# Altium schematic sheet [14] 1ST_AP1302 ISP.SchDoc
size A3; DocumentNumber: 14; SheetNumber: 14; SheetTotal: 16
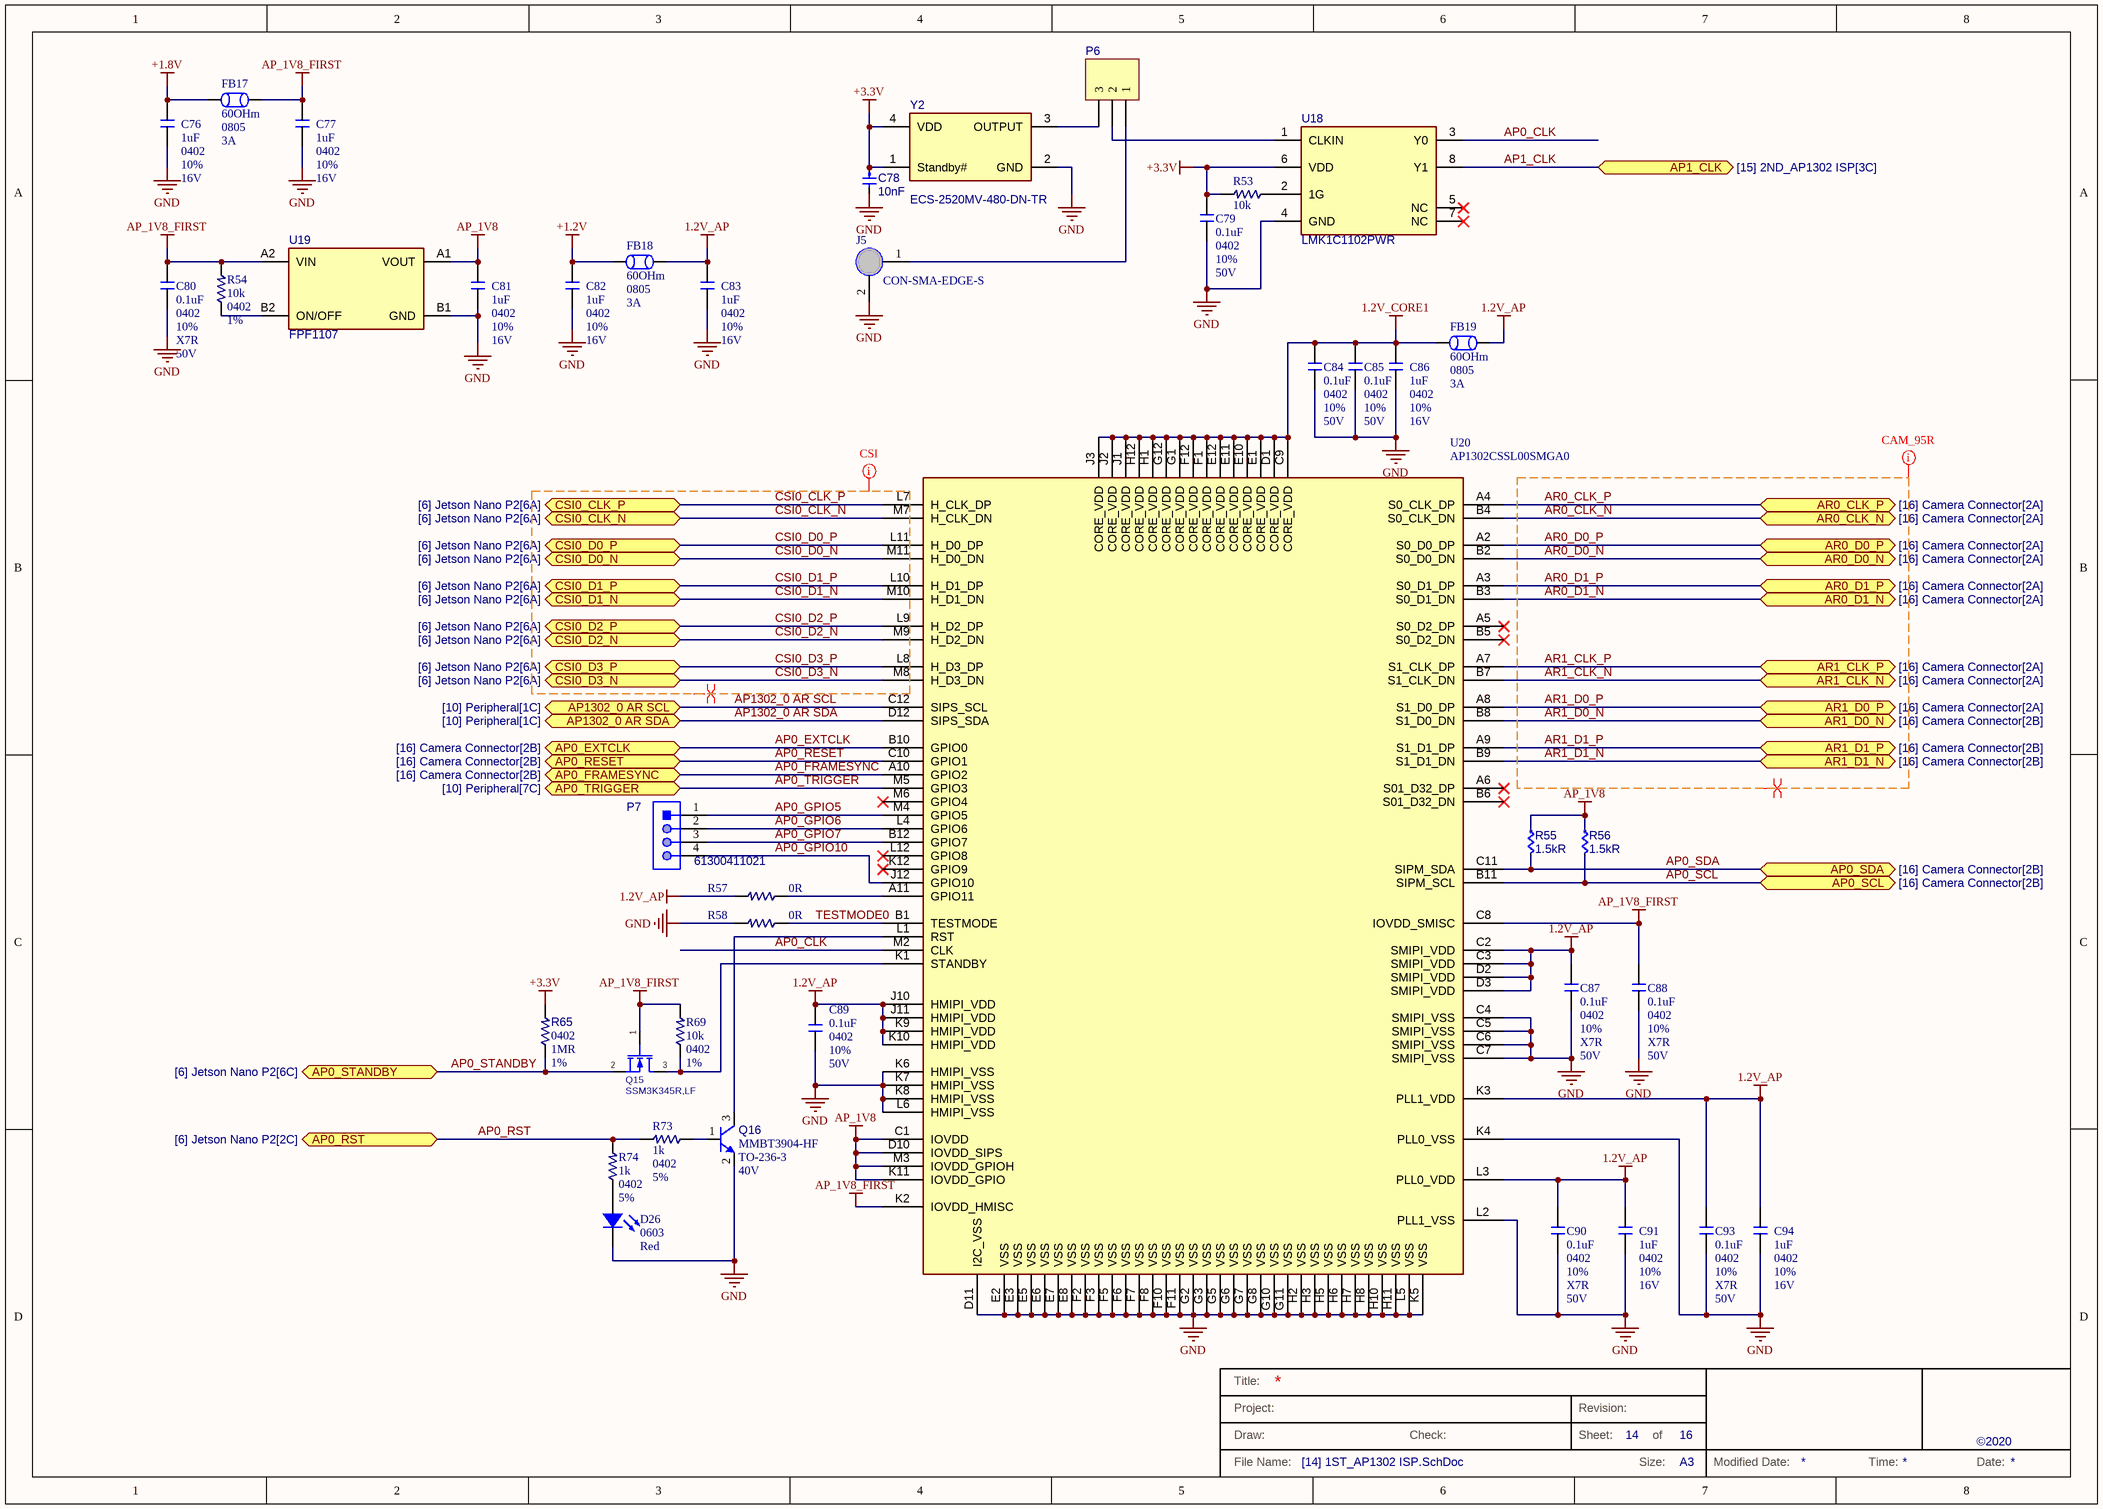
[diagram p0: [14] 1ST_AP1302 ISP.SchDoc]

## Parts
C76  1uF  Case Code (Imperial): 0402  Tolerance: 10%  Voltage: 16V  [C0402M]
C77  1uF  Case Code (Imperial): 0402  Tolerance: 10%  Voltage: 16V  [C0402M]
C78  Capacitance: 10nF  [CAP0402-M]  (hidden comment: 885012205050)
C79  0.1uF  Case/Package: 0402  Tolerance: 10%  Voltage: 50V  [C0402M]
C80  0.1uF  Case/Package: 0402  Tolerance: 10%  Dielectric: X7R  Voltage: 50V  [C0402M]
C81  1uF  Case Code (Imperial): 0402  Tolerance: 10%  Voltage: 16V  [C0402M]
C82  1uF  Case Code (Imperial): 0402  Tolerance: 10%  Voltage: 16V  [C0402M]
C83  1uF  Case Code (Imperial): 0402  Tolerance: 10%  Voltage: 16V  [C0402M]
C84  0.1uF  Case/Package: 0402  Tolerance: 10%  Voltage: 50V  [C0402M]
C85  0.1uF  Case/Package: 0402  Tolerance: 10%  Voltage: 50V  [C0402M]
C86  1uF  Case Code (Imperial): 0402  Tolerance: 10%  Voltage: 16V  [C0402M]
C87  0.1uF  Case/Package: 0402  Tolerance: 10%  Dielectric: X7R  Voltage: 50V  [C0402M]
C88  0.1uF  Case/Package: 0402  Tolerance: 10%  Dielectric: X7R  Voltage: 50V  [C0402M]
C89  0.1uF  Case/Package: 0402  Tolerance: 10%  Voltage: 50V  [C0402M]
C90  0.1uF  Case/Package: 0402  Tolerance: 10%  Dielectric: X7R  Voltage: 50V  [C0402M]
C91  1uF  Case Code (Imperial): 0402  Tolerance: 10%  Voltage: 16V  [C0402M]
C93  0.1uF  Case/Package: 0402  Tolerance: 10%  Dielectric: X7R  Voltage: 50V  [C0402M]
C94  1uF  Case Code (Imperial): 0402  Tolerance: 10%  Voltage: 16V  [C0402M]
D26  Case/Package: 0603  Color: Red  [LED-0603]  (hidden comment: LTST-C190CKT)
FB17  60OHm  Case Code (Imperial): 0805  Max DC Current: 3A  [R0805M]
FB18  60OHm  Case Code (Imperial): 0805  Max DC Current: 3A  [R0805M]
FB19  60OHm  Case Code (Imperial): 0805  Max DC Current: 3A  [R0805M]
J5  CON-SMA-EDGE-S  [CON-SMA-EDGE-S]
P6  Header 3  [HDR1X3]  (value not drawn)  (no BOM)
P7  61300411021  [61300411021]
Q15  SSM3K345R,LF  [SSM3K345R,LF-Footprint-1]
Q16  Manufacturer Part Number 1: MMBT3904-HF  Case/Package: TO-236-3  Collector Emitter Breakdown Voltage: 40V  [SOT55P160X90-3N]  (hidden comment: NPN)
R53  10k  [R0402M]
R54  10k  Case Code (Imperial): 0402  Tolerance: 1%  [R0402M]
R55  Resistance: 1.5kR  [RES0402]  (hidden comment: ERJ-2RKF1501X)
R56  Resistance: 1.5kR  [RES0402]  (hidden comment: ERJ-2RKF1501X)
R57  Resistance: 0R  [R0402M]  (hidden comment: RC0402FR-070RL)
R58  Resistance: 0R  [R0402M]  (hidden comment: RC0402FR-070RL)
R65  Case Code (Imperial): 0402  Resistance: 1MR  Tolerance: 1%  [R0402M]  (hidden comment: 1M)
R69  10k  Case Code (Imperial): 0402  Tolerance: 1%  [R0402M]
R73  1k  Case Code (Imperial): 0402  Tolerance: 5%  [R0402M]
R74  1k  Case Code (Imperial): 0402  Tolerance: 5%  [R0402M]
U18  LMK1C1102PWR  [LMK1C1102PWR]
U19  FPF1107  [FPF1107]
U20  AP1302CSSL00SMGA0  [AP1302CSSL00SMGA0]
Y2  ECS-2520MV-480-DN-TR  [ECS-2520MV-480-DN-TR]

## Ports
AP0_EXTCLK (bidir, see [16] Camera Connector[2B]), AP0_FRAMESYNC (bidir, see [16] Camera Connector[2B]), AP0_RESET (bidir, see [16] Camera Connector[2B]), AP0_RST (bidir, see [6] Jetson Nano P2[2C]), AP0_SCL (bidir, see [16] Camera Connector[2B]), AP0_SDA (bidir, see [16] Camera Connector[2B]), AP0_STANDBY (bidir, see [6] Jetson Nano P2[6C]), AP0_TRIGGER (bidir, see [10] Peripheral[7C]), AP1_CLK (bidir, see [15] 2ND_AP1302 ISP[3C]), AP1302_0 AR SCL (bidir, see [10] Peripheral[1C]), AP1302_0 AR SDA (bidir, see [10] Peripheral[1C]), AR0_CLK_N (bidir, see [16] Camera Connector[2A]), AR0_CLK_P (bidir, see [16] Camera Connector[2A]), AR0_D0_N (bidir, see [16] Camera Connector[2A]), AR0_D0_P (bidir, see [16] Camera Connector[2A]), AR0_D1_N (bidir, see [16] Camera Connector[2A]), AR0_D1_P (bidir, see [16] Camera Connector[2A]), AR1_CLK_N (bidir, see [16] Camera Connector[2A]), AR1_CLK_P (bidir, see [16] Camera Connector[2A]), AR1_D0_N (bidir, see [16] Camera Connector[2B]), AR1_D0_P (bidir, see [16] Camera Connector[2A]), AR1_D1_N (bidir, see [16] Camera Connector[2B]), AR1_D1_P (bidir, see [16] Camera Connector[2B]), CSI0_CLK_N (bidir, see [6] Jetson Nano P2[6A]), CSI0_CLK_P (bidir, see [6] Jetson Nano P2[6A]), CSI0_D0_N (bidir, see [6] Jetson Nano P2[6A]), CSI0_D0_P (bidir, see [6] Jetson Nano P2[6A]), CSI0_D1_N (bidir, see [6] Jetson Nano P2[6A]), CSI0_D1_P (bidir, see [6] Jetson Nano P2[6A]), CSI0_D2_N (bidir, see [6] Jetson Nano P2[6A]), CSI0_D2_P (bidir, see [6] Jetson Nano P2[6A]), CSI0_D3_N (bidir, see [6] Jetson Nano P2[6A]), CSI0_D3_P (bidir, see [6] Jetson Nano P2[6A])

## Nets
1.2V_AP: C83.1 C87.1 C89.1 C90.1 C91.1 C93.1 C94.1 FB18.1 FB19.1 R57.1 U20.C2(SMIPI_VDD) U20.C3(SMIPI_VDD) U20.D2(SMIPI_VDD) U20.D3(SMIPI_VDD) U20.J10(HMIPI_VDD) U20.J11(HMIPI_VDD) U20.K3(PLL1_VDD) U20.K9(HMIPI_VDD) U20.K10(HMIPI_VDD) U20.L3(PLL0_VDD)
1.2V_CORE1: C84.1 C85.1 C86.1 FB19.2 U20.C9(CORE_VDD) U20.D1(CORE_VDD) U20.E1(CORE_VDD) U20.E10(CORE_VDD) U20.E11(CORE_VDD) U20.E12(CORE_VDD) U20.F1(CORE_VDD) U20.F12(CORE_VDD) U20.G1(CORE_VDD) U20.G12(CORE_VDD) U20.H1(CORE_VDD) U20.H12(CORE_VDD) U20.J1(CORE_VDD) U20.J2(CORE_VDD) U20.J3(CORE_VDD)
+1.2V: C82.1 FB18.2
+1.8V: C76.1 FB17.2
+3.3V: C78.1 C79.1 R53.1 R65.1 U18.6(VDD) Y2.1(Standby#) Y2.4(VDD)
AP_1V8: C81.1 R55.1 R56.1 U19.A1(VOUT) U20.C1(IOVDD) U20.D10(IOVDD_SIPS) U20.K11(IOVDD_GPIO) U20.M3(IOVDD_GPIOH)
AP_1V8_FIRST: C77.1 C80.1 C88.1 FB17.1 Q15.1(G) R54.1 R69.1 U19.A2(VIN) U20.C8(IOVDD_SMISC) U20.K2(IOVDD_HMISC)
GND: C76.2 C77.2 C78.2 C79.2 C80.2 C81.2 C82.2 C83.2 C84.2 C85.2 C86.2 C87.2 C88.2 C89.2 C90.2 C91.2 C93.2 C94.2 D26.2(K) J5.2(GND) Q16.2(E) R58.1 U18.4(GND) U19.B1(GND) U20.C4(SMIPI_VSS) U20.C5(SMIPI_VSS) U20.C6(SMIPI_VSS) U20.C7(SMIPI_VSS) U20.D11(I2C_VSS) U20.E2(VSS) U20.E3(VSS) U20.E5(VSS) U20.E6(VSS) U20.E7(VSS) U20.E8(VSS) U20.F2(VSS) U20.F3(VSS) U20.F5(VSS) U20.F6(VSS) U20.F7(VSS) U20.F8(VSS) U20.F10(VSS) U20.F11(VSS) U20.G2(VSS) U20.G3(VSS) U20.G5(VSS) U20.G6(VSS) U20.G7(VSS) U20.G8(VSS) U20.G10(VSS) U20.G11(VSS) U20.H2(VSS) U20.H3(VSS) U20.H5(VSS) U20.H6(VSS) U20.H7(VSS) U20.H8(VSS) U20.H10(VSS) U20.H11(VSS) U20.K4(PLL0_VSS) U20.K5(VSS) U20.K6(HMIPI_VSS) U20.K7(HMIPI_VSS) U20.K8(HMIPI_VSS) U20.L2(PLL1_VSS) U20.L5(VSS) U20.L6(HMIPI_VSS) Y2.2(GND)
AP0_CLK: U18.3(Y0) U20.M2(CLK)
AP0_EXTCLK: U20.B10(GPIO0) ; port AP0_EXTCLK
AP0_FRAMESYNC: U20.A10(GPIO2) ; port AP0_FRAMESYNC
AP0_GPIO5: P7.1 U20.M4(GPIO5)
AP0_GPIO6: P7.2 U20.L4(GPIO6)
AP0_GPIO7: P7.3 U20.B12(GPIO7)
AP0_GPIO10: P7.4 U20.J12(GPIO10)
AP0_RESET: U20.C10(GPIO1) ; port AP0_RESET
AP0_RST: R73.1 R74.1 ; port AP0_RST
AP0_SCL: R56.2 U20.B11(SIPM_SCL) ; port AP0_SCL
AP0_SDA: R55.2 U20.C11(SIPM_SDA) ; port AP0_SDA
AP0_STANDBY: Q15.2(S) R65.2 ; port AP0_STANDBY
AP0_TRIGGER: U20.M5(GPIO3) ; port AP0_TRIGGER
AP1_CLK: U18.8(Y1) ; port AP1_CLK
AP1302_0 AR SCL: U20.C12(SIPS_SCL) ; port AP1302_0 AR SCL
AP1302_0 AR SDA: U20.D12(SIPS_SDA) ; port AP1302_0 AR SDA
AR0_CLK_N: U20.B4(S0_CLK_DN) ; port AR0_CLK_N
AR0_CLK_P: U20.A4(S0_CLK_DP) ; port AR0_CLK_P
AR0_D0_N: U20.B2(S0_D0_DN) ; port AR0_D0_N
AR0_D0_P: U20.A2(S0_D0_DP) ; port AR0_D0_P
AR0_D1_N: U20.B3(S0_D1_DN) ; port AR0_D1_N
AR0_D1_P: U20.A3(S0_D1_DP) ; port AR0_D1_P
AR1_CLK_N: U20.B7(S1_CLK_DN) ; port AR1_CLK_N
AR1_CLK_P: U20.A7(S1_CLK_DP) ; port AR1_CLK_P
AR1_D0_N: U20.B8(S1_D0_DN) ; port AR1_D0_N
AR1_D0_P: U20.A8(S1_D0_DP) ; port AR1_D0_P
AR1_D1_N: U20.B9(S1_D1_DN) ; port AR1_D1_N
AR1_D1_P: U20.A9(S1_D1_DP) ; port AR1_D1_P
CSI0_CLK_N: U20.M7(H_CLK_DN) ; port CSI0_CLK_N
CSI0_CLK_P: U20.L7(H_CLK_DP) ; port CSI0_CLK_P
CSI0_D0_N: U20.M11(H_D0_DN) ; port CSI0_D0_N
CSI0_D0_P: U20.L11(H_D0_DP) ; port CSI0_D0_P
CSI0_D1_N: U20.M10(H_D1_DN) ; port CSI0_D1_N
CSI0_D1_P: U20.L10(H_D1_DP) ; port CSI0_D1_P
CSI0_D2_N: U20.M9(H_D2_DN) ; port CSI0_D2_N
CSI0_D2_P: U20.L9(H_D2_DP) ; port CSI0_D2_P
CSI0_D3_N: U20.M8(H_D3_DN) ; port CSI0_D3_N
CSI0_D3_P: U20.L8(H_D3_DP) ; port CSI0_D3_P
TESTMODE0: R58.2 U20.B1(TESTMODE)
NetD26_1: D26.1(A) R74.2
NetJ5_1: J5.1(SIG) P6.1
NetP6_2: P6.2 U18.1(CLKIN)
NetP6_3: P6.3 Y2.3(OUTPUT)
NetQ15_3: Q15.3(D) R69.2 U20.K1(STANDBY)
NetQ16_1: Q16.1(B) R73.2
NetQ16_3: Q16.3(C) U20.L1(RST)
NetR53_2: R53.2 U18.2(1G)
NetR54_2: R54.2 U19.B2(ON/OFF)
NetR57_2: R57.2 U20.A11(GPIO11)

Not connected (* = marked no-connect by the designer): U18 5(NC)* 7(NC)*; U20 A5(S0_D2_DP)* A6(S01_D32_DP)* B5(S0_D2_DN)* B6(S01_D32_DN)* K12(GPIO9)* L12(GPIO8)* M6(GPIO4)*

## Layout directives
net class CAM_95R: AR0_CLK_N, AR0_CLK_P, AR0_D0_N, AR0_D0_P, AR0_D1_N, AR0_D1_P, AR1_CLK_N, AR1_CLK_P, AR1_D0_N, AR1_D0_P, AR1_D1_N, AR1_D1_P
differential pair: AR0_CLK_N, AR0_CLK_P, AR0_D0_N, AR0_D0_P, AR0_D1_N, AR0_D1_P, AR1_CLK_N, AR1_CLK_P, AR1_D0_N, AR1_D0_P, AR1_D1_N, AR1_D1_P, CSI0_CLK_N, CSI0_CLK_P, CSI0_D0_N, CSI0_D0_P, CSI0_D1_N, CSI0_D1_P, CSI0_D2_N, CSI0_D2_P, CSI0_D3_N, CSI0_D3_P
net class CSI: CSI0_CLK_N, CSI0_CLK_P, CSI0_D0_N, CSI0_D0_P, CSI0_D1_N, CSI0_D1_P, CSI0_D2_N, CSI0_D2_P, CSI0_D3_N, CSI0_D3_P

## Notes on the sheet
- Title:
- Project:
- Draw:
- Check:
- Revision:
- Sheet:
- of
- ©2020
- File Name:
- Size:
- A3
- Modified Date:
- Time:
- Date:

## Library data of the parts
C76 C77 C81-C83 C86 C91 C94 = CAP_CER: SAMSUNG ELECTRO-MECHANICS - CL05A105KO5NNNC - SMD Multilayer Ceramic Capacitor, 1 µF, 16 V, 0402 [1005 Metric], ± 10%, X5R, CL Series; Supplier 1: Digi-Key; Supplier Part Number 1: 1276-1067-1-ND; Manufacturer 1: Samsung; Manufacturer Part Number 1: CL05A105KO5NNNC; Stock 1: 1039902; Pricing 1: 1=0.10000, 10=0.04600, 50=0.02520, 100=0.02050, 500=0.01466, 1000=0.01151, 2500=0.01046, 5000=0.00963 (USD); RoHS: Yes; Mount: Surface Mount; Case/Package: 0402; Case Code (Metric): 1005; Contact Plating: Tin; Min Operating Temperature: -55°C; Max Operating Temperature: 85°C; Capacitance: 1uF; Dielectric: X5R; Packaging: Tape and Reel; Package Quantity: 1; Voltage Rating: 16V; Series: CL; Construction: Flat; Length: 1mm; Width: 0.02inch; Height: 0.5mm; Thickness: 0.022inch; Depth: 0.5mm; Radiation Hardening: No; RoHS Compliant: Yes; ComponentLink1URL: https://datasheet.ciiva.com/16207/cl05a105ko5nnnc-16207571.pdf?src-supplier=Future+Electronics; ComponentLink1Description: https://datasheet.ciiva.com/16207/cl05a105ko5nnnc-16207571.pdf?src-supplier=Future+Electronics; ComponentLink2URL: https://datasheet.ciiva.com/15195/getdatasheetpartid-355272-15195629.pdf?src-supplier=Verical; ComponentLink2Description: https://datasheet.ciiva.com/15195/getdatasheetpartid-355272-15195629.pdf?src-supplier=Verical
C78 = CMP-01521-1: CAP CER 10000PF 25V X7R 0402; Manufacturer 1: Würth Elektronik; Tolerance: 10%; RoHS Compliant: Yes; Thickness: 0.022inch; Case Code (Imperial): 0402; Length: 0.039inch; Width: 0.02inch; Mount: Surface Mount; Voltage Rating: 25V; Case/Package: 0402; Min Operating Temperature: -55°C; Max Operating Temperature: 125°C; Case Code (Metric): 1005; Manufacturer Part Number 1: 885012205050; Packaging: Tape and Reel
C79 C80 C84 C85 C87-C90 C93 = CAP_CER: CAP CER 0.1UF 50V X7R 0402; Manufacturer: Murata; Manufacturer Part Number: GRM155R71H104KE14D; Material: Ceramic; Capacitance: 100nF; Dissipation Factor: 0.025%; ComponentLink1URL: https://datasheet.ciiva.com/25741/cl10b104kb8nnnl-25741341.pdf?src-supplier=Digi-Key; ComponentLink1Description: https://datasheet.ciiva.com/25741/cl10b104kb8nnnl-25741341.pdf?src-supplier=Digi-Key; ComponentLink2URL: https://datasheet.ciiva.com/26838/getdatasheetpartid-357523-26838415.pdf?src-supplier=Verical; ComponentLink2Description: https://datasheet.ciiva.com/26838/getdatasheetpartid-357523-26838415.pdf?src-supplier=Verical; Supplier 1: Digi-Key; Supplier Part Number 1: 490-10700-1-ND; Stock 1: 2282266; Pricing 1: 1 = 0.10000, 10 = 0.04600, 100 = 0.02050, 500 = 0.01464, 1000 = 0.01150, 2500 = 0.01045, 5000 = 0.00961 (USD); RoHS: Yes; Mount: Surface Mount; Weight: 0.000212oz; Case Code (Metric): 1005; Case Code (Imperial): 0402; Dielectric Material: Ceramic; Min Operating Temperature: -55°C; Max Operating Temperature: 125°C; Packaging: Tape and Reel; Voltage Rating: 50V; Termination: SMD/SMT; Composition: Ceramic; Voltage Rating (DC): 50V; Package Quantity: 10000; Length: 1mm; Height: 0.5mm; Width: 0.5mm; Thickness: 0.022inch; Depth: 0.5mm; REACH SVHC: No SVHC; Lead Free: Lead Free; ComponentLink3URL: http://www.farnell.com/datasheets/2079156.pdf?src-supplier=Farnell; ComponentLink3Description: http://www.farnell.com/datasheets/2079156.pdf?src-supplier=Farnell; ComponentLink4URL: http://www.mouser.com/ds/2/281/c02e-2905.pdf?src-supplier=Mouser; ComponentLink4Description: http://www.mouser.com/ds/2/281/c02e-2905.pdf?src-supplier=Mouser; ComponentLink5URL: http://components.arrow.com/part/dataview/0323_07030614?src-supplier=Arrow+Europe; ComponentLink5Description: http://components.arrow.com/part/dataview/0323_07030614?src-supplier=Arrow+Europe; ComponentLink6URL: https://search.murata.co.jp/Ceramy/image/img/A01X/G101/ENG/GRM155R71H104KE14-01.pdf?src-supplier=Digi-Key; ComponentLink6Description: https://search.murata.co.jp/Ceramy/image/img/A01X/G101/ENG/GRM155R71H104KE14-01.pdf?src-supplier=Digi-Key; ComponentLink7URL: http://psearch.en.murata.com/capacitor/product/GRM155R71H104KE14%23.pdf?src-supplier=Avnet; ComponentLink7Description: http://psearch.en.murata.com/capacitor/product/GRM155R71H104KE14%23.pdf?src-supplier=Avnet; ComponentLink8URL: http://www.farnell.com/datasheets/2079156.pdf?src-supplier=Element14; ComponentLink8Description: http://www.farnell.com/datasheets/2079156.pdf?src-supplier=Element14; ComponentLink9URL: http://www.farnell.com/datasheets/2079156.pdf?src-supplier=Newark; ComponentLink9Description: http://www.farnell.com/datasheets/2079156.pdf?src-supplier=Newark
  C79 C84 C85 C89: Dielectric: X7R
D26 = Led: LED RED CLEAR CHIP SMD; Manufacturer 1: Vishay Lite-On; Lens Color: Colorless; Lens Style: Diffused,Colorless,Rectangular,Clear; Forward Voltage: 1.8V; Viewing Angle: 130°; Forward Current: 20mA; Luminous Intensity: 10mcd; Dominant Wavelength: 638nm; Test Current: 10mA; Number of Elements: 1; Power Dissipation: 62.5mW; Wavelength: 660nm; Reverse Voltage: 5V; Power Rating: 100mW; Supplier 1: Digi-Key; Supplier Part Number 1: 160-1181-1-ND; Manufacturer Part Number 1: LTST-C190CKT; RoHS: Yes; Category: LEDs; Stock 1: 143500; Pricing 1: 1=0.30000 (USD); Mount: Surface Mount; Number of Pins: 2; Case Code (Metric): 1608; Case Code (Imperial): 0603; Min Operating Temperature: -30°C; Max Operating Temperature: 85°C; Packaging: Tape and Reel; Package Quantity: 1; Illumination Color: Red; Lens Transparency: Clear; Number of LEDs: 1; Max Power Dissipation: 100mW; Length: 1.6mm; Width: 0.8mm; Height: 0.8mm; Depth: 0.8mm; Radiation Hardening: No; Lead Free: Lead Free; RoHS Compliant: Yes; ComponentLink1URL: https://datasheet.ciiva.com/2110/ltst-c190ckt-2110129.pdf?src-supplier=Digi-Key; ComponentLink1Description: https://datasheet.ciiva.com/2110/ltst-c190ckt-2110129.pdf?src-supplier=Digi-Key; ComponentLink2URL: https://datasheet.ciiva.com/15201/getdatasheetpartid-245581-15201387.pdf?src-supplier=Verical; ComponentLink2Description: https://datasheet.ciiva.com/15201/getdatasheetpartid-245581-15201387.pdf?src-supplier=Verical; ComponentLink3URL: https://datasheet.ciiva.com/11773/0900766b80dc029f-11773615.pdf?src-supplier=RSComponents; ComponentLink3Description: https://datasheet.ciiva.com/11773/0900766b80dc029f-11773615.pdf?src-supplier=RSComponents; ComponentLink4URL: https://datasheet.ciiva.com/12400/lite-on-ltst-c190ckt-187378-12400679.pdf?src-supplier=Mouser; ComponentLink4Description: https://datasheet.ciiva.com/12400/lite-on-ltst-c190ckt-187378-12400679.pdf?src-supplier=Mouser; ComponentLink5URL: https://datasheet.ciiva.com/16287/lite-on20ltst-c190ckt-16287002.pdf?src-supplier=Future+Electronics; ComponentLink5Description: https://datasheet.ciiva.com/16287/lite-on20ltst-c190ckt-16287002.pdf?src-supplier=Future+Electronics; ComponentLink6URL: https://datasheet.ciiva.com/2110/ltst-c190ckt-2110131.pdf?src-supplier=Digi-Key; ComponentLink6Description: https://datasheet.ciiva.com/2110/ltst-c190ckt-2110131.pdf?src-supplier=Digi-Key; ComponentLink7URL: https://datasheet.ciiva.com/2110/ltst-c190ckt-2110130.pdf?src-supplier=Digi-Key; ComponentLink7Description: https://datasheet.ciiva.com/2110/ltst-c190ckt-2110130.pdf?src-supplier=Digi-Key
FB17-FB19 = FB: TAIYO YUDEN - BKP2125HS600-T - Ferrite Bead, 0805 [2012 Metric], 60 ohm, 3 A, BKP Series, 0.025 ohm, ± 25%; Impedance: 60R; DC Resistance (DCR): 25mR; Test Frequency: 100MHz; Number of Lines: 1; Shielding: Unshielded; Supplier 1: Digi-Key; Supplier Part Number 1: 587-1932-1-ND; Manufacturer 1: Taiyo Yuden; Manufacturer Part Number 1: BKP2125HS600-T; Stock 1: 181157; Pricing 1: 1=0.12000, 10=0.09400, 25=0.08480, 50=0.06200, 100=0.05360, 250=0.04232, 500=0.03574, 1000=0.03010 (USD); RoHS: Yes; Mount: Surface Mount; Case/Package: 0805; Number of Pins: 2; Core Material: Ferrite; Case Code (Metric): 2125; Min Operating Temperature: -55°C; Max Operating Temperature: 85°C; Tolerance: 25%; Packaging: Tape and Reel; Package Quantity: 1; Termination: SMD/SMT; Max Current Rating: 3A; Resistance: 25mR; Series: BK; Length: 2.3mm; Width: 0.049inch; Height: 1.05mm; Depth: 1.45mm; RoHS Compliant: Yes; Lead Free: Lead Free; Halogen Free: Halogen Free; REACH SVHC: Unknown; ComponentLink1URL: https://datasheet.ciiva.com/6213/bkp2125hs600-t-ss-6213090.pdf?src-supplier=Digi-Key; ComponentLink1Description: https://datasheet.ciiva.com/6213/bkp2125hs600-t-ss-6213090.pdf?src-supplier=Digi-Key; ComponentLink2URL: https://datasheet.ciiva.com/30063/884bkp2125hs600-t-30063956.pdf?src-supplier=Onlinecomponents.com; ComponentLink2Description: https://datasheet.ciiva.com/30063/884bkp2125hs600-t-30063956.pdf?src-supplier=Onlinecomponents.com; ComponentLink3URL: https://datasheet.ciiva.com/6213/mlci08-e-6213094.pdf?src-supplier=Digi-Key; ComponentLink3Description: https://datasheet.ciiva.com/6213/mlci08-e-6213094.pdf?src-supplier=Digi-Key; ComponentLink4URL: https://datasheet.ciiva.com/6213/mlci08-e-6213097.pdf?src-supplier=Digi-Key; ComponentLink4Description: https://datasheet.ciiva.com/6213/mlci08-e-6213097.pdf?src-supplier=Digi-Key
J5 = AntenaIPX: Sma Female Connector, Pcb Edge Mount Rohs Compliant: Yes; Manufacturer 1: RF Solutions; Connector Type: SMA,Socket; Number of Ports: 1; Supplier 1: RSComponents; Supplier Part Number 1: 1258191; Manufacturer Part Number 1: CON-SMA-EDGE-S; RoHS: Yes; Category: RF / Coaxial Connectors; Stock 1: 594; Pricing 1: 1=2.06000, 10=1.56000 (GBP); Mount: Edge; Case/Package: SMA; Package Quantity: 1; Fastening Type: Threaded; Termination: Solder; ComponentLink1URL: https://media.digikey.com/pdf/Data%20Sheets/RF%20Solutions%20PDFs/CON-SMA-EDGE.pdf?src-supplier=Digi-Key; ComponentLink1Description: https://media.digikey.com/pdf/Data%20Sheets/RF%20Solutions%20PDFs/CON-SMA-EDGE.pdf?src-supplier=Digi-Key
P6 = Header 3: Header, 3-Pin; LatestRevisionDate: 17-Jul-2002; LatestRevisionNote: Re-released for DXP Platform.; Publisher: Altium Limited
P7 = WE-CN-1P-M-R4: CONN HEADER VERT 4POS 2.54MM; Manufacturer: Würth Elektronik GmbH; Manufacturer Part Number: 61300411021; Supplier 1: RSComponents; Supplier Part Number 1: 8281658
Q15 = CMP-00698-1: MOSFET N-CHANNEL 20V 4A SOT23F; Manufacturer 1: Toshiba Semiconductor and Storage; Manufacturer Part Number 1: SSM3K345R,LF
Q16 = NPN: TRANS NPN 40V 0.2A SOT523; Manufacturer 1: Comchip; Collector Emitter Voltage (VCEO): 300mV; Max Collector Current: 200mA; Max Power Dissipation: 200mW; Transition Frequency: 300MHz; Element Configuration: Single; Collector Base Voltage (VCBO): 60V; Emitter Base Voltage (VEBO): 6V; Supplier 1: Digi-Key; Supplier Part Number 1: 641-1683-1-ND; Stock 1: 63354; Pricing 1: 1=0.19000, 10=0.17600, 100=0.09590, 500=0.05900, 1000=0.04023 (USD); RoHS: Yes; Mount: Surface Mount; Min Operating Temperature: -55°C; Max Operating Temperature: 150°C; Packaging: Tape and Reel; Package Quantity: 3000; Polarity: NPN; Collector Emitter Saturation Voltage: 300mV; Gain Bandwidth Product: 300MHz; Continuous Collector Current: 200mA; Collector-emitter Voltage-Max: 300mV; Series: -; Max Breakdown Voltage: 40V; RoHS Compliant: Yes; ComponentLink1URL: https://datasheet.ciiva.com/12075/mmbt3904-hf20reva265354-44540-12075939.pdf?src-supplier=Mouser; ComponentLink1Description: https://datasheet.ciiva.com/12075/mmbt3904-hf20reva265354-44540-12075939.pdf?src-supplier=Mouser; ComponentLink2URL: https://datasheet.ciiva.com/2957/mmbt3904-hf20reva265354-2957612.pdf?src-supplier=Digi-Key; ComponentLink2Description: https://datasheet.ciiva.com/2957/mmbt3904-hf20reva265354-2957612.pdf?src-supplier=Digi-Key
R53 R54 R69 = RES_SMD: RES SMD 10K OHM 1% 1/16W 0402; Manufacturer: Yageo; Manufacturer Part Number: RC0402FR-0710KL; Resistance: 10kR; Temperature Coefficient: 100ppm/°C; Voltage Rating (DC): 50V; Power Rating: 62.5mW; Supplier 1: Digi-Key; Supplier Part Number 1: 311-10.0KLRTR-ND; Stock 1: 58760000; Pricing 1: 10000 = 0.001630, 30000 = 0.001440, 50000 = 0.001320, 100000 = 0.001290 (USD); RoHS: Yes; Case/Package: 0402; Number of Pins: 2; Case Code (Metric): 1005; Min Operating Temperature: -55°C; Max Operating Temperature: 155°C; Composition: Thick Film; Packaging: Tape and Reel; Voltage Rating: 50V; Termination: SMD/SMT; Military Standard: Not; Working Voltage: 50V; Number of Terminations: 2; Length: 1mm; Height: 0.32mm; Width: 0.5mm; Depth: 0.5mm; Lead Pitch: 0.2mm; REACH SVHC: No SVHC; Lead Free: Lead Free; ComponentLink1URL: https://datasheet.ciiva.com/7660/38568-7660787.pdf?src-supplier=Element14; ComponentLink1Description: https://datasheet.ciiva.com/7660/38568-7660787.pdf?src-supplier=Element14; ComponentLink2URL: https://datasheet.ciiva.com/7849/1784430-7849813.pdf?src-supplier=Element14; ComponentLink2Description: https://datasheet.ciiva.com/7849/1784430-7849813.pdf?src-supplier=Element14; ComponentLink3URL: https://datasheet.ciiva.com/7849/1686128-7849814.pdf?src-supplier=Element14; ComponentLink3Description: https://datasheet.ciiva.com/7849/1686128-7849814.pdf?src-supplier=Element14; ComponentLink4URL: https://datasheet.ciiva.com/7849/1784430-7849815.pdf?src-supplier=Element14; ComponentLink4Description: https://datasheet.ciiva.com/7849/1784430-7849815.pdf?src-supplier=Element14; ComponentLink5URL: https://datasheet.ciiva.com/22747/1018594-22747512.pdf?src-supplier=Element14; ComponentLink5Description: https://datasheet.ciiva.com/22747/1018594-22747512.pdf?src-supplier=Element14; ComponentLink6URL: https://datasheet.ciiva.com/12667/pyu-rc0402-51-rohs-l-6-r-12667067.pdf?src-supplier=Mouser; ComponentLink6Description: https://datasheet.ciiva.com/12667/pyu-rc0402-51-rohs-l-6-r-12667067.pdf?src-supplier=Mouser; ComponentLink7URL: https://datasheet.ciiva.com/7983/1018594-7983486.pdf?src-supplier=Element14; ComponentLink7Description: https://datasheet.ciiva.com/7983/1018594-7983486.pdf?src-supplier=Element14
  R53: Case Code (Imperial): 0402; Tolerance: 1%
R55 R56 = CMP-00609-2: RES SMD 1.5K OHM 1% 1/10W 0402; Manufacturer 1: Panasonic Electronic Components; Voltage Rating: 50V; Temperature Coefficient: 100ppm/°C; Power Rating: 100mW; Width: 0.02inch; Max Operating Temperature: 155°C; Number of Pins: 2; Contact Plating: Tin; Case Code (Imperial): 0402; Features: Automotive AEC-Q200; Mount: Surface Mount; Depth: 0.5mm; Package Quantity: 1; Composition: Thick Film; Tolerance: 1%; Voltage Rating (DC): 50V; Manufacturer Part Number 1: ERJ-2RKF1501X; REACH SVHC: No SVHC; Max Power Dissipation: 100mW; Length: 1mm; Military Standard: Not; Case Code (Metric): 1005; Number of Terminations: 2; Case/Package: 0402; Lead Free: Lead Free; Min Operating Temperature: -55°C; Height: 0.35mm; Termination: SMD/SMT; Packaging: Tape and Reel; Radiation Hardening: No
R57 R58 = RES_SMD: RC Series 0402 0.063 W 0 Ohm Jumper Surface Mount Thick Film Chip Resistor; Manufacturer 1: Yageo; Tolerance: 1%; Power Rating: 62.5mW; Voltage Rating: 50V; Temperature Coefficient: 200ppm/°C; Max Power Dissipation: 63mW; Supplier 1: Digi-Key; Supplier Part Number 1: 311-0.0LRCT-ND; Manufacturer Part Number 1: RC0402FR-070RL; Stock 1: 2177900; Pricing 1: 1=0.10000, 10=0.01200, 25=0.00840, 50=0.00640, 100=0.00470, 250=0.00360, 500=0.00288, 1000=0.00212, 5000=0.00152 (USD); RoHS: Yes; Mount: Surface Mount; Case/Package: 0402; Contact Plating: Tin,Matte; Case Code (Imperial): 0402; Case Code (Metric): 1005; Size Code: 0402; Min Operating Temperature: -55°C; Max Operating Temperature: 155°C; Resistor Type: Thick Film; Packaging: Tape and Reel; Termination: SMD/SMT; Features: Moisture Resistant; Series: RC; Number of Terminations: 2; Length: 1mm; Width: 0.5mm; Height: 0.35mm; Radiation Hardening: No; Lead Free: Lead Free; RoHS Compliant: Yes; ComponentLink1URL: https://datasheet.ciiva.com/8896/pyu-rc0402-51-rohs-l-6-8896149.pdf?src-supplier=Avnet; ComponentLink1Description: https://datasheet.ciiva.com/8896/pyu-rc0402-51-rohs-l-6-8896149.pdf?src-supplier=Avnet; ComponentLink2URL: https://datasheet.ciiva.com/16790/pyu-rc0402-51-rohs-l-6-r-16790444.pdf?src-supplier=Future+Electronics; ComponentLink2Description: https://datasheet.ciiva.com/16790/pyu-rc0402-51-rohs-l-6-r-16790444.pdf?src-supplier=Future+Electronics; ComponentLink3URL: https://datasheet.ciiva.com/28419/pyu-rc0402-51-rohs-l-6-28419661.pdf?src-supplier=Avnet+Europe; ComponentLink3Description: https://datasheet.ciiva.com/28419/pyu-rc0402-51-rohs-l-6-28419661.pdf?src-supplier=Avnet+Europe; ComponentLink4URL: https://datasheet.ciiva.com/16869/pyu-rc0402-51-rohs-l-6-16869518.pdf?src-supplier=Avnet+Europe; ComponentLink4Description: https://datasheet.ciiva.com/16869/pyu-rc0402-51-rohs-l-6-16869518.pdf?src-supplier=Avnet+Europe
R65 = RES_SMD_17: RES SMD 1M OHM 1% 1/16W 0402; Manufacturer: Yageo; Manufacturer Part Number: RC0402FR-071ML; Power Rating: 63mW; Voltage Rating: 50V; Temperature Coefficient: 100ppm/°C; Supplier 1: Digi-Key; Supplier Part Number 1: 311-1.00MLRCT-ND; Stock 1: 5211374; Pricing 1: 1 = 0.10000, 10 = 0.01400, 100 = 0.00580, 1000 = 0.00260, 2500 = 0.00226, 5000 = 0.00186 (USD); RoHS: Yes; Case/Package: 0402; Case Code (Metric): 1005; Min Operating Temperature: -55°C; Max Operating Temperature: 155°C; Resistor Type: Thick Film; Packaging: Tape and Reel; Termination: SMD/SMT; Length: 1mm; Height: 0.32mm; Depth: 0.5mm; REACH SVHC: Unknown; Military Standard: Not; Lead Free: Lead Free; ComponentLink1URL: https://datasheet.ciiva.com/11808/0900766b80c66297-11808125.pdf?src-supplier=RSComponents; ComponentLink1Description: https://datasheet.ciiva.com/11808/0900766b80c66297-11808125.pdf?src-supplier=RSComponents; ComponentLink2URL: https://datasheet.ciiva.com/46394/1018594-46394951.pdf?src-supplier=Element14; ComponentLink2Description: https://datasheet.ciiva.com/46394/1018594-46394951.pdf?src-supplier=Element14; ComponentLink3URL: https://datasheet.ciiva.com/16741/pyu-rc0402-51-rohs-l-6-r-16741081.pdf?src-supplier=Future+Electronics; ComponentLink3Description: https://datasheet.ciiva.com/16741/pyu-rc0402-51-rohs-l-6-r-16741081.pdf?src-supplier=Future+Electronics; ComponentLink4URL: https://datasheet.ciiva.com/7849/1018594-7849882.pdf?src-supplier=Element14; ComponentLink4Description: https://datasheet.ciiva.com/7849/1018594-7849882.pdf?src-supplier=Element14; ComponentLink5URL: https://datasheet.ciiva.com/7849/1018594-7849883.pdf?src-supplier=Element14; ComponentLink5Description: https://datasheet.ciiva.com/7849/1018594-7849883.pdf?src-supplier=Element14
R73 R74 = RES_SMD: RES SMD 1K OHM 5% 1/16W 0402; Manufacturer: Yageo; Manufacturer Part Number: RC0402JR-071KL; Resistance: 1kR; Power Rating: 62.5mW; Voltage Rating: 50V; Temperature Coefficient: 100ppm/°C; Max Power Dissipation: 63mW; ComponentLink1URL: https://datasheet.ciiva.com/16855/pyu-rc0201-51-rohs-l-8-16855270.pdf?src-supplier=Avnet+Europe; ComponentLink1Description: https://datasheet.ciiva.com/16855/pyu-rc0201-51-rohs-l-8-16855270.pdf?src-supplier=Avnet+Europe; ComponentLink2URL: https://datasheet.ciiva.com/7672/1563626-7672265.pdf?src-supplier=Element14; ComponentLink2Description: https://datasheet.ciiva.com/7672/1563626-7672265.pdf?src-supplier=Element14; ComponentLink3URL: https://datasheet.ciiva.com/7660/1421516-7660811.pdf?src-supplier=Element14; ComponentLink3Description: https://datasheet.ciiva.com/7660/1421516-7660811.pdf?src-supplier=Element14; ComponentLink4URL: https://datasheet.ciiva.com/46391/1421516-46391293.pdf?src-supplier=Element14; ComponentLink4Description: https://datasheet.ciiva.com/46391/1421516-46391293.pdf?src-supplier=Element14; ComponentLink5URL: https://datasheet.ciiva.com/2462/pyu-r-int-thick-7-2462830.pdf?src-supplier=Digi-Key; ComponentLink5Description: https://datasheet.ciiva.com/2462/pyu-r-int-thick-7-2462830.pdf?src-supplier=Digi-Key; ComponentLink6URL: https://datasheet.ciiva.com/2462/pyu-r-int-thick-7-2462831.pdf?src-supplier=Digi-Key; ComponentLink6Description: https://datasheet.ciiva.com/2462/pyu-r-int-thick-7-2462831.pdf?src-supplier=Digi-Key; ComponentLink7URL: https://datasheet.ciiva.com/8896/pyu-rc0201-51-rohs-l-8-8896175.pdf?src-supplier=Avnet; ComponentLink7Description: https://datasheet.ciiva.com/8896/pyu-rc0201-51-rohs-l-8-8896175.pdf?src-supplier=Avnet; ComponentLink8URL: https://datasheet.ciiva.com/28419/pyu-rc0201-51-rohs-l-8-28419638.pdf?src-supplier=Avnet+Europe; ComponentLink8Description: https://datasheet.ciiva.com/28419/pyu-rc0201-51-rohs-l-8-28419638.pdf?src-supplier=Avnet+Europe; ComponentLink9URL: https://datasheet.ciiva.com/7672/1563626-7672264.pdf?src-supplier=Element14; ComponentLink9Description: https://datasheet.ciiva.com/7672/1563626-7672264.pdf?src-supplier=Element14; ComponentLink10URL: https://datasheet.ciiva.com/2462/pyu-r-int-thick-7-2462829.pdf?src-supplier=Digi-Key; ComponentLink10Description: https://datasheet.ciiva.com/2462/pyu-r-int-thick-7-2462829.pdf?src-supplier=Digi-Key; Supplier 1: Digi-Key; Supplier Part Number 1: 311-1.0KJRCT-ND; Stock 1: 0; Pricing 1: 1 = 0.10000, 10 = 0.01300, 100 = 0.00530, 1000 = 0.00236, 2500 = 0.00205, 5000 = 0.00169 (USD); RoHS: Yes; Case/Package: 0402; Case Code (Metric): 1005; Min Operating Temperature: -55°C; Max Operating Temperature: 155°C; Packaging: Tape and Reel; Package Quantity: 1; Termination: SMD/SMT; Composition: Thick Film; Number of Terminations: 2; Military Standard: Not; Features: Moisture Resistant; Length: 0.039inch; Height: 0.016inch; Width: 0.02inch; Depth: 0.5mm; REACH SVHC: No SVHC; Lead Free: Lead Free; ComponentLink11URL: https://datasheet.ciiva.com/2452/pyu-r-int-thick-7-2452755.pdf?src-supplier=Digi-Key; ComponentLink11Description: https://datasheet.ciiva.com/2452/pyu-r-int-thick-7-2452755.pdf?src-supplier=Digi-Key; ComponentLink12URL: https://datasheet.ciiva.com/2452/pyu-r-int-thick-7-2452756.pdf?src-supplier=Digi-Key; ComponentLink12Description: https://datasheet.ciiva.com/2452/pyu-r-int-thick-7-2452756.pdf?src-supplier=Digi-Key; ComponentLink13URL: https://datasheet.ciiva.com/2452/pyu-r-int-thick-7-2452757.pdf?src-supplier=Digi-Key; ComponentLink13Description: https://datasheet.ciiva.com/2452/pyu-r-int-thick-7-2452757.pdf?src-supplier=Digi-Key; ComponentLink14URL: https://datasheet.ciiva.com/7983/1018594-7983558.pdf?src-supplier=Element14; ComponentLink14Description: https://datasheet.ciiva.com/7983/1018594-7983558.pdf?src-supplier=Element14; ComponentLink15URL: https://datasheet.ciiva.com/7850/1018594-7850170.pdf?src-supplier=Element14; ComponentLink15Description: https://datasheet.ciiva.com/7850/1018594-7850170.pdf?src-supplier=Element14; ComponentLink16URL: https://datasheet.ciiva.com/7850/1018594-7850171.pdf?src-supplier=Element14; ComponentLink16Description: https://datasheet.ciiva.com/7850/1018594-7850171.pdf?src-supplier=Element14; ComponentLink17URL: https://datasheet.ciiva.com/17081/pyu-rc0402-51-rohs-l-6-r-17081438.pdf?src-supplier=Future+Electronics; ComponentLink17Description: https://datasheet.ciiva.com/17081/pyu-rc0402-51-rohs-l-6-r-17081438.pdf?src-supplier=Future+Electronics
U18 = LMK1C1102PWR: Clock Buffer LVCMOS 1: 4 1.8V/2.5V/3.3V 8-Pin TSSOP T/R; Manufacturer: Texas Instruments; Supplier 1: Mouser; Manufacturer Part Number: LMK1C1102PWR; RoHS: Yes; Category: Clock Buffers, Drivers; Pricing 1: 1=1.64000, 10=1.48000, 25=1.40000, 50=1.40000, 100=1.19000, 250=1.12000, 500=0.97400, 1000=0.80800, 2000=0.80700, 10000=0.80700 (USD); Supplier Part Number 1: 595-LMK1C1102PWR
U19 = FPF1107: IC PWR SWITCH P-CHAN 1:1 4WLCSP; Manufacturer: ON Semiconductor / Fairchild; Number of Outputs: 1; Interface: On/Off; Max Output Current: 1.2A; On-State Resistance: 150mR; Turn-Off Delay Time: 2.5us; Turn-On Delay Time: 95us; Output Configuration: High Side; Max Power Dissipation: 1W; Nominal Supply Current: 3uA; Max Input Voltage: 4V; Min Input Voltage: 1.2V; Supplier 1: Mouser; Manufacturer Part Number: FPF1107; RoHS: Yes; Category: Hot Swap Controllers; Stock 1: 5853; Pricing 1: 1=0.47000, 10=0.37100, 50=0.37100, 100=0.27600, 1000=0.18000, 10000=0.15000 (USD); Mount: Surface Mount; Number of Pins: 4; Weight: 0.042g; Min Operating Temperature: -40°C; Max Operating Temperature: 85°C; Packaging: Tape and Reel; Package Quantity: 3000; Power Dissipation: 1W; Series: IntelliMAX™; Supply Current: 3uA; Max Supply Voltage: 4V; Min Supply Voltage: 1.2V; Voltage: 4V; Current: 1.2A; Length: 0.96mm; Width: 0.96mm; Height: 0.332mm; RoHS Compliant: Yes; ComponentLink1URL: https://datasheet.ciiva.com/29593/fpf1107-29593602.pdf?src-supplier=Digi-Key; ComponentLink1Description: https://datasheet.ciiva.com/29593/fpf1107-29593602.pdf?src-supplier=Digi-Key; ComponentLink2URL: https://datasheet.ciiva.com/12083/fpf1107-107680-12083402.pdf?src-supplier=Mouser; ComponentLink2Description: https://datasheet.ciiva.com/12083/fpf1107-107680-12083402.pdf?src-supplier=Mouser; ComponentLink3URL: https://datasheet.ciiva.com/3233/fpf1107-3233067.pdf?src-supplier=Avnet; ComponentLink3Description: https://datasheet.ciiva.com/3233/fpf1107-3233067.pdf?src-supplier=Avnet; ComponentLink4URL: https://datasheet.ciiva.com/29593/fpf1107-29593637.pdf?src-supplier=Digi-Key; ComponentLink4Description: https://datasheet.ciiva.com/29593/fpf1107-29593637.pdf?src-supplier=Digi-Key; Supplier Part Number 1: 512-FPF1107
U20 = AP1302: IMAGE SENSOR 13 MP CO-PROCESSOR; Manufacturer: ON Semiconductor; Manufacturer Part Number: AP1302CSSL00SMGA0-DR; Supplier 1: Mouser; RoHS: Yes; Category: Optoelectronics; Stock 1: 3840; Pricing 1: 3840=6.59000, 10000=6.59000 (USD); Mount: Surface Mount; Packaging: Tray; Lead Free: Lead Free; ComponentLink1URL: http://www.onsemi.com/PowerSolutions/product.do?id=AP1302&pdf=Y&src-supplier=Avnet; ComponentLink1Description: http://www.onsemi.com/PowerSolutions/product.do?id=AP1302&pdf=Y&src-supplier=Avnet; Supplier Part Number 1: 863-AP1302CSSL00SMDR
Y2 = ASFLMB-48.000MHZ-LR-T: XTAL OSC XO 48.0000MHZ CMOS SMD; Manufacturer: ECS International; Supplier 1: Mouser; Supplier Part Number 1: 520-2520MV-480-DN-TR; Manufacturer Part Number: ECS-2520MV-480-DN-TR; Stock 1: 6000; Pricing 1: 1=1.31000, 10=1.26000, 50=1.23000, 100=1.05000, 1000=0.86000, 10000=0.81700 (USD)